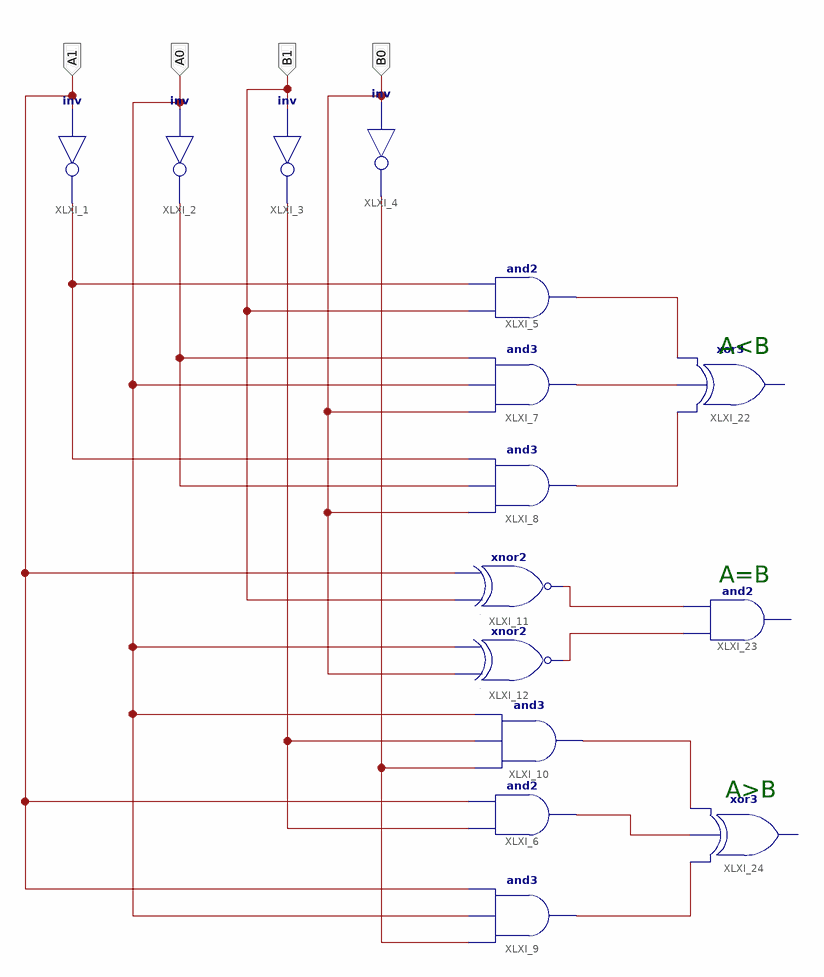
[diagram p0: schematic sheet 1]
// Xilinx ISE schematic CompareA_B.sch (spartan6) as structural Verilog: 15 symbols, 4 ports
module CompareA_B (
  input  A1,
  input  A0,
  input  B1,
  input  B0
);

  wire XLXN_1, XLXN_7, XLXN_11, XLXN_12, XLXN_13, XLXN_17, XLXN_18, XLXN_22, XLXN_24, XLXN_28, XLXN_29,
       XLXN_30;

  not XLXI_1 (XLXN_1, A1);
  not XLXI_2 (XLXN_7, A0);
  not XLXI_3 (XLXN_22, B1);
  not XLXI_4 (XLXN_24, B0);
  and XLXI_5 (XLXN_11, B1, XLXN_1);
  and XLXI_6 (XLXN_29, XLXN_22, A1);
  and XLXI_7 (XLXN_12, B0, A0, XLXN_7);
  and XLXI_8 (XLXN_13, B0, XLXN_7, XLXN_1);
  and XLXI_9 (XLXN_30, XLXN_24, A0, A1);
  and XLXI_10 (XLXN_28, XLXN_24, XLXN_22, A0);
  xnor XLXI_11 (XLXN_17, B1, A1);
  xnor XLXI_12 (XLXN_18, B0, A0);
  // xor3 XLXI_22 has open pins: I0=XLXN_13, I1=XLXN_12, I2=XLXN_11, O=open
  // and2 XLXI_23 has open pins: I0=XLXN_18, I1=XLXN_17, O=open
  // xor3 XLXI_24 has open pins: I0=XLXN_30, I1=XLXN_29, I2=XLXN_28, O=open

  // Notes on the sheet:
  //   A<B
  //   A=B
  //   A>B
endmodule
